# EAGLE design HallSensor (EAGLE 5.04)
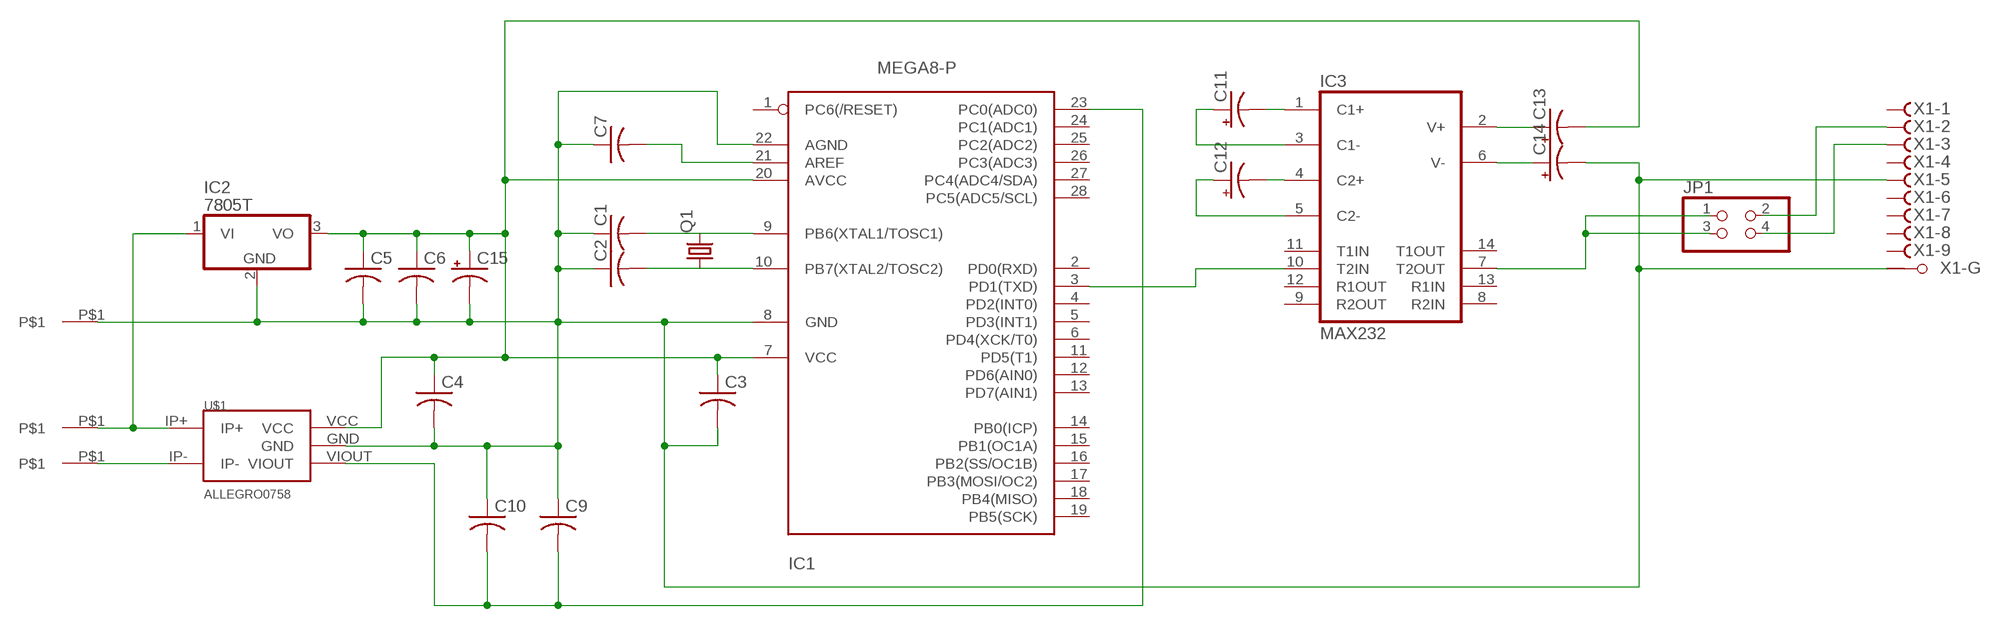
[diagram p0: schematic, sheet 1]

## Parts
C1  C-USC0805K  [C0805K]
C2  C-USC0805K  [C0805K]
C3  C-USC0805K  [C0805K]
C4  C-USC0805K  [C0805K]
C5  C-USC0805K  [C0805K]
C6  C-US025-050X050  [C025-050X050]
C7  C-USC0805K  [C0805K]
C9  C-USC0805K  [C0805K]
C10  C-US025-050X050  [C025-050X050]
C11  CPOL-US153CLV-0505  [153CLV-0505]
C12  CPOL-US153CLV-0505  [153CLV-0505]
C13  CPOL-US153CLV-0505  [153CLV-0505]
C14  CPOL-US153CLV-0505  [153CLV-0505]
C15  CPOL-US153CLV-0505  [153CLV-0505]
IC1  MEGA8-P  [DIL28-3]
IC2  7805T  [TO220H]
IC3  MAX232  [DIL16]
JP1  PINHD-2X2  [2X02]
Q1  CRYSTALTC26H  [TC26H]
U$1  ALLEGRO0758  [PSS]
U$2  TERMINAL  [TERMINAL]
U$3  TERMINAL  [TERMINAL]
U$4  TERMINAL  [TERMINAL]
X1  F09HPS  [F09HP]

## Nets
GND: C1.1 C2.1 C3.2 C4.2 C5.2 C6.2 C7.1 C9.1 C10.1 C14.- C15.- IC1.8(GND) IC1.22(AGND) IC2.2(GND) U$1.GND U$4.P$1 X1.5(-5:F) X1.G1(-G:G1)
N$1: C2.2 IC1.10(PB7(XTAL2/TOSC2)) Q1.1
N$2: C1.2 IC1.9(PB6(XTAL1/TOSC1)) Q1.2
N$3: C9.2 C10.2 IC1.23(PC0(ADC0)) U$1.VIOUT
N$6: C12.- IC3.4(C2+)
N$7: C7.2 IC1.21(AREF)
N$8: C11.- IC3.1(C1+)
N$9: C11.+ IC3.3(C1-)
N$10: C12.+ IC3.5(C2-)
N$11: C14.+ IC3.6(V-)
N$12: C13.+ IC3.2(V+)
N$13: IC1.3(PD1(TXD)) IC3.10(T2IN)
N$14: IC3.7(T2OUT) JP1.1 JP1.3
N$15: JP1.2 X1.2(-2:F)
N$16: JP1.4 X1.3(-3:F)
N$19: U$1.IP- U$3.P$1
N$20: IC2.1(VI) U$1.IP+ U$2.P$1
VCC: C3.1 C4.1 C5.1 C6.1 C13.- C15.+ IC1.7(VCC) IC1.20(AVCC) IC2.3(VO) U$1.VCC
Unconnected: IC1.1(PC6(/RESET)) IC1.2(PD0(RXD)) IC1.4(PD2(INT0)) IC1.5(PD3(INT1)) IC1.6(PD4(XCK/T0)) IC1.11(PD5(T1)) IC1.12(PD6(AIN0)) IC1.13(PD7(AIN1)) IC1.14(PB0(ICP)) IC1.15(PB1(OC1A)) IC1.16(PB2(SS/OC1B)) IC1.17(PB3(MOSI/OC2)) IC1.18(PB4(MISO)) IC1.19(PB5(SCK)) IC1.24(PC1(ADC1)) IC1.25(PC2(ADC2)) IC1.26(PC3(ADC3)) IC1.27(PC4(ADC4/SDA)) IC1.28(PC5(ADC5/SCL)) IC3.8(R2IN) IC3.9(R2OUT) IC3.11(T1IN) IC3.12(R1OUT) IC3.13(R1IN) IC3.14(T1OUT) X1.1(-1:F) X1.4(-4:F) X1.6(-6:F) X1.7(-7:F) X1.8(-8:F) X1.9(-9:F) X1.G2(-G:G2)

## Power pins joined to a net without a drawn wire
GND: IC3.15(GND)
VCC: IC3.16(VCC)

## Library data of the parts
C1-C7 C9 C10 = resistor:C-US: CAPACITOR, American symbol
C11-C15 = resistor:CPOL-US: POLARIZED CAPACITOR, American symbol
IC1 = atmel:MEGA8-P: MICROCONTROLLER 8 Kbytes FLASH, 1 kbytes SRAM, 512 bytes EEPROM, USART, 4-channel 10 bit ADC, 2-channel 8 bit ADC Pin compatible with Atmega48, ATMega88, ATMega168 Source: avr.lbr
IC2 = linear:78*: Positive VOLTAGE REGULATOR Source: http://cache.national.com/ds/LM/LM78L05.pdf http://www.fairchildsemi.com/ds/LM/LM7805.pdf
IC3 = maxim:MAX232: RS232 TRANSEIVER
JP1 = pinhead:PINHD-2X2: PIN HEADER
Q1 = crystal:CRYSTAL: CRYSTAL
U$1 = Needle Lib:ALLEGRO0758
U$2-U$4 = Needle Lib:TERMINAL
X1 = con-subd:F09HPS: SUB-D

## Board
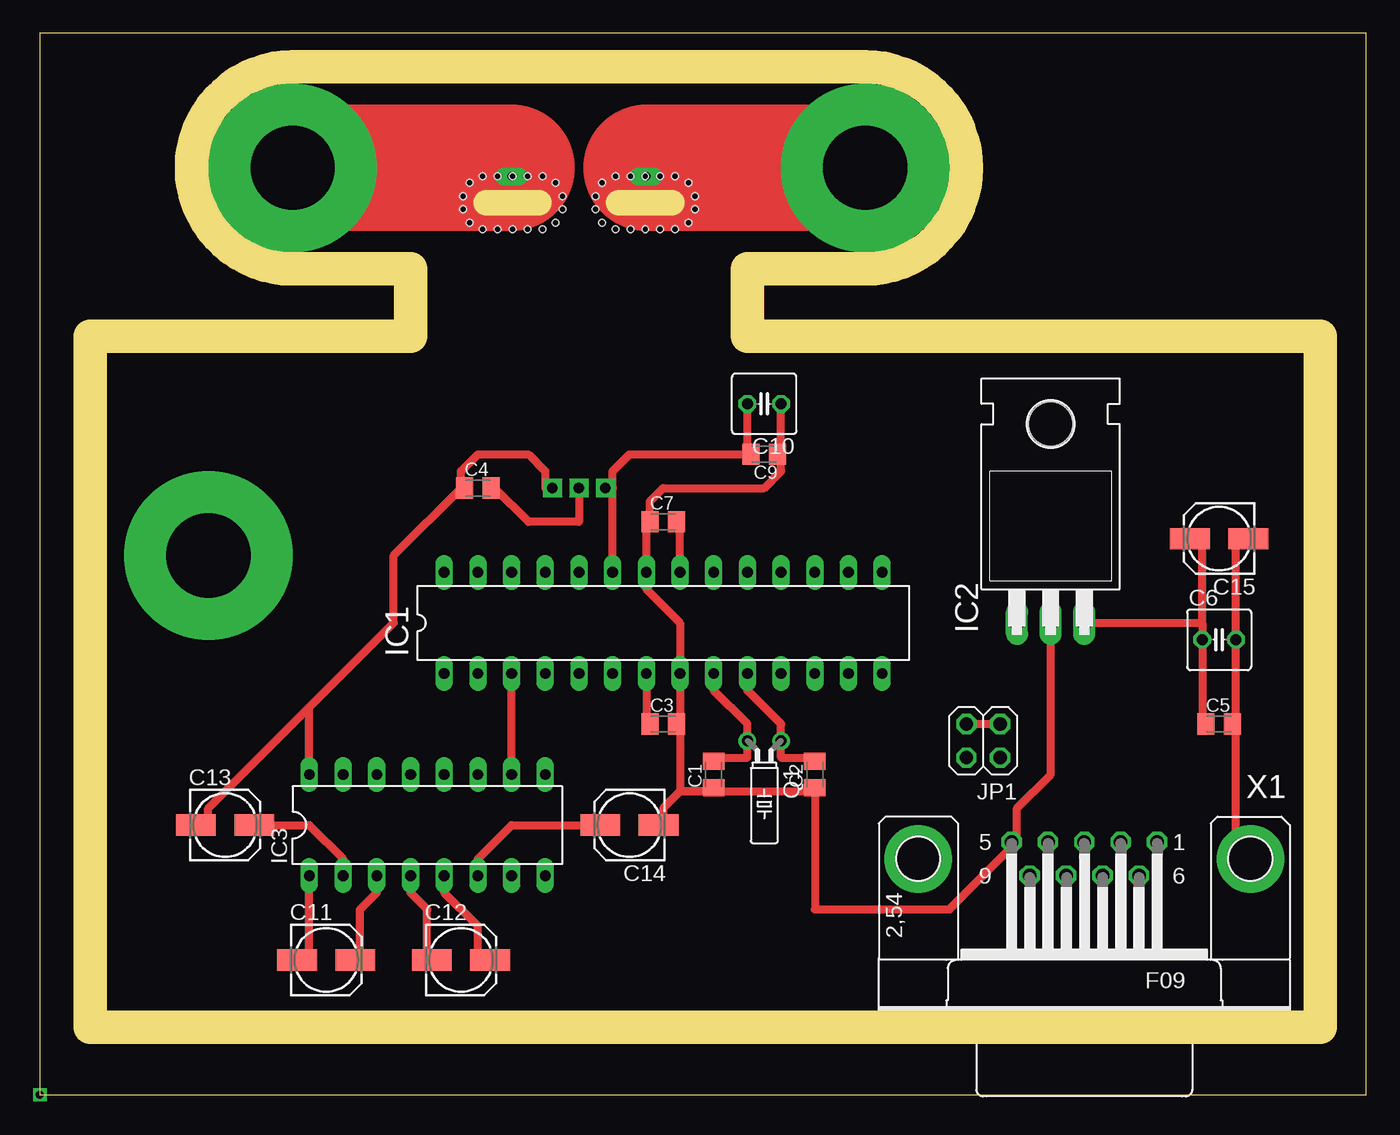
[diagram p1: board, top side]
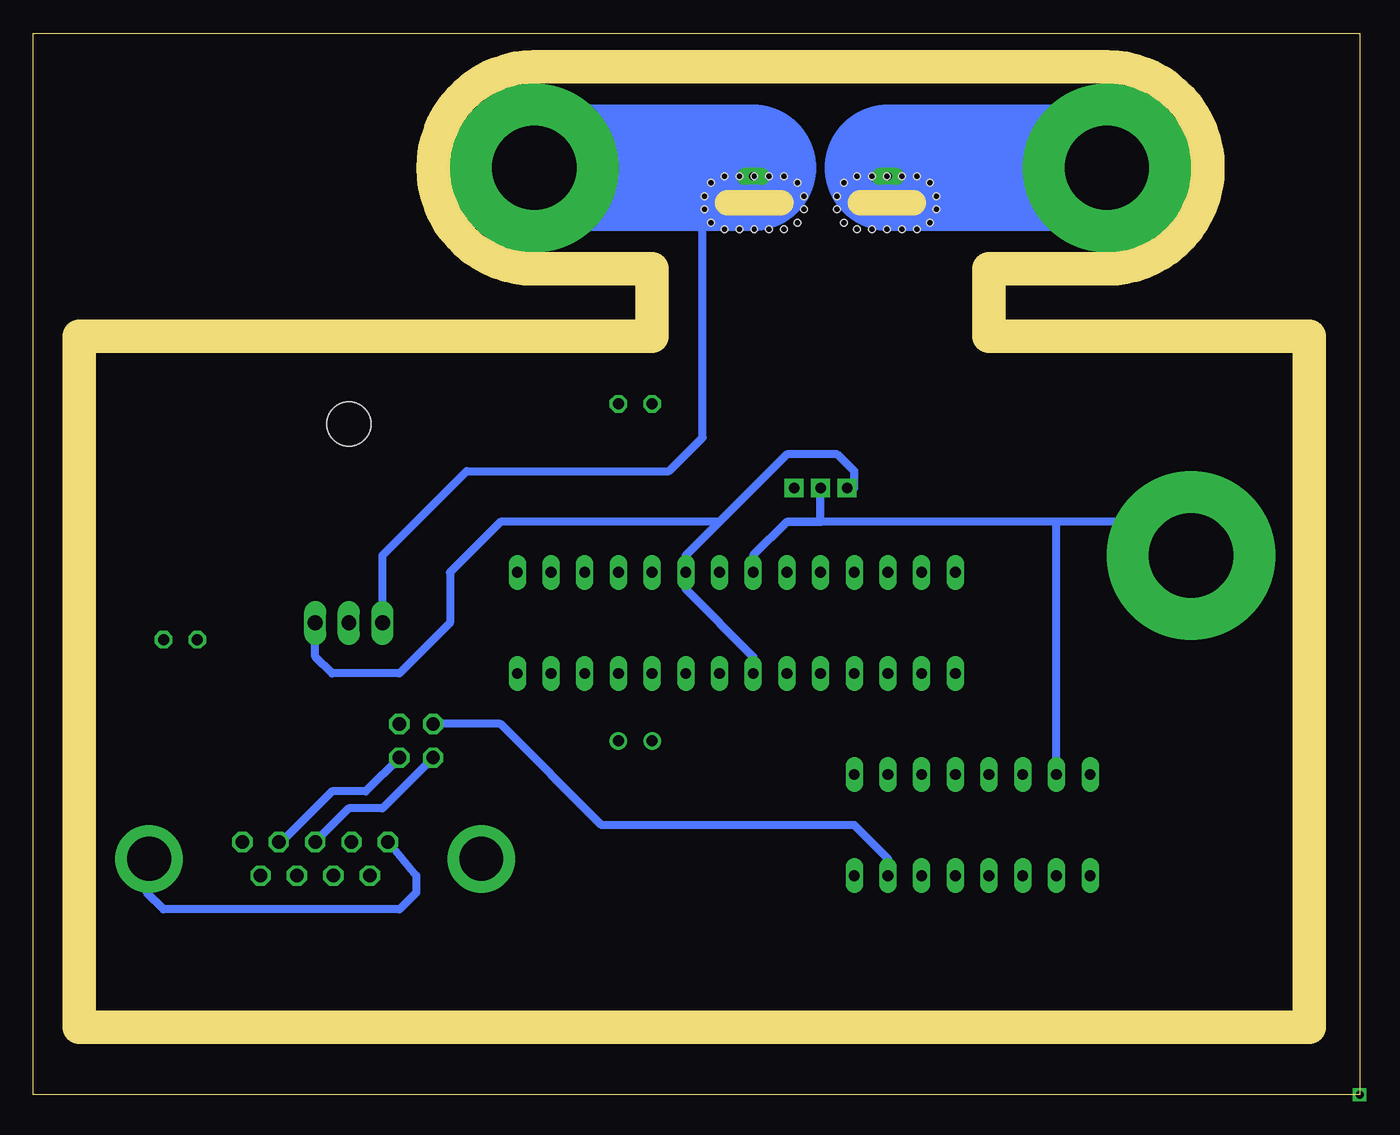
[diagram p2: board, bottom side, seen from below]

Size 100 x 80 mm. Coordinates in mm from the lower left corner, seen from the top.
Outline: 0,0 100,0 100,80 0,80 0,0
Copper layers (1*16): Top 0.035mm / dielectric 1.5mm / Bottom 0.035mm
Design rules "default": minimum track width 10mil, minimum drill 24mil, track to track 8mil, track to pad 8mil, pad to pad 8mil, via to via 8mil, smd to smd 8mil, copper to edge 40mil, drill to drill 8mil, minimum pad ring 10mil, minimum via ring 8mil, stop-mask expansion 4mil, vias tented up to drill 0mil, thermal gap 10mil
Milling: 14 lines

### Footprints (pad centres in the part's own frame; a part is rotated, then mirrored left to right if it is on the bottom)
C0805K = smd 1.3 x 1.6: 1 -1,0; 2 1,0
C025-050X050 = drill 0.813 octagon: 1 -1.27,0; 2 1.27,0
153CLV-0505 = smd 3 x 1.6: + 2.2,0; - -2.2,0
DIL28-3 = drill 0.813 long: 1 -16.51,-3.81; 2 -13.97,-3.81; 3 -11.43,-3.81; 4 -8.89,-3.81; 5 -6.35,-3.81; 6 -3.81,-3.81; 7 -1.27,-3.81; 8 1.27,-3.81; 9 3.81,-3.81; 10 6.35,-3.81; 11 8.89,-3.81; 12 11.43,-3.81; 13 13.97,-3.81; 14 16.51,-3.81; 15 16.51,3.81; 16 13.97,3.81; 17 11.43,3.81; 18 8.89,3.81; 19 6.35,3.81; 20 3.81,3.81; 21 1.27,3.81; 22 -1.27,3.81; 23 -3.81,3.81; 24 -6.35,3.81; 25 -8.89,3.81; 26 -11.43,3.81; 27 -13.97,3.81; 28 -16.51,3.81
TO220H = drill 1.118 long: 1 -2.54,-10.16; 2 0,-10.16; 3 2.54,-10.16 | hole 3.302: 0,4.826
DIL16 = drill 0.813 long: 1 -8.89,-3.81; 2 -6.35,-3.81; 3 -3.81,-3.81; 4 -1.27,-3.81; 5 1.27,-3.81; 6 3.81,-3.81; 7 6.35,-3.81; 8 8.89,-3.81; 9 8.89,3.81; 10 6.35,3.81; 11 3.81,3.81; 12 1.27,3.81; 13 -1.27,3.81; 14 -3.81,3.81; 15 -6.35,3.81; 16 -8.89,3.81
2X02 = drill 1.016 octagon: 1 -1.27,-1.27; 2 -1.27,1.27; 3 1.27,-1.27; 4 1.27,1.27
TC26H = drill 0.813 round: 1 -1.27,0; 2 1.27,0
PSS = drill 0.8 pad 1.422 square: GND 0,0; VCC -2,0; VIOUT 2,0 | drill 0.6 pad 1.27 long: IP+ 5.08,23.495; IP- -5.08,23.495 | hole 0.5: -7.25,19.5; -2.75,19.5; -3.875,19.5; -5,19.5; -6.125,19.5; -7.25,23.5; -6.125,23.5; -5,23.5; -3.875,23.5; -2.75,23.5; -1.75,23; -1.75,20; -1.25,21; -1.25,22; -8.25,23; -8.75,22; -8.75,21; -8.25,20; 2.75,19.5; 7.25,19.5; 6.125,19.5; 5,19.5; 3.875,19.5; 2.75,23.5; 3.875,23.5; 5,23.5; 6.125,23.5; 7.25,23.5; 8.25,23; 8.25,20; 8.75,21; 8.75,22; 1.75,23; 1.25,22; 1.25,21; 1.75,20
TERMINAL = drill 6.35 pad 12.7 round: P$1 0,0
F09HP = drill 1.016 octagon: 1 -5.486,-1.27; 2 -2.743,-1.27; 3 0,-1.27; 4 2.743,-1.27; 5 5.486,-1.27; 6 -4.115,1.27; 7 -1.372,1.27; 8 1.372,1.27; 9 4.115,1.27 | drill 3.302 pad 5.08 round: G1 -12.522,0; G2 12.522,0

### Placement (x,y rotation side)
C1  50.8,24.13 90 top
C2  58.42,24.13 90 top
C3  46.99,27.94 0 top
C4  33.02,45.72 0 top
C5  88.9,27.94 0 top
C6  88.9,34.29 0 top
C7  46.99,43.18 0 top
C9  54.61,48.26 180 top
C10  54.61,52.07 180 top
C11  21.59,10.16 0 top
C12  31.75,10.16 0 top
C13  13.97,20.32 0 top
C14  44.45,20.32 180 top
C15  88.9,41.91 180 top
IC1  46.99,35.56 0 top
IC2  76.2,45.72 0 top
IC3  29.21,20.32 0 top
JP1  71.12,26.67 180 top
Q1  54.61,26.67 180 top
U$1  40.64,45.72 0 top
U$2  62.23,69.85 0 top
U$3  19.05,69.85 0 top
U$4  12.7,40.64 0 top
X1  78.74,17.78 180 top

### Tracks (layer width: path | path; a pad name or v marks a point on that pad's centre or on a via)
GND
  Top 0.254: 90.17,41.91 C15.- | 90.17,27.94 C5.2 | 34.29,45.72 C4.2 | 45.72,43.18 C7.1 | 50.8,22.86 C1.1 | 48.26,27.94 C3.2 | 46.99,20.32 C14.- | 58.42,22.86 C2.1
  Top 0.61: 90.17,41.91 C6.2 90.17,27.94 90.17,19.05 X1.G1 | 73.66,19.05 73.66,21.59 76.2,24.13 IC2.2 | 34.29,45.72 36.83,43.18 40.64,43.18 U$1.GND | 55.88,48.26 C10.1 | 45.72,43.18 IC1.22 45.72,38.1 48.26,35.56 IC1.8 48.26,27.94 48.26,22.86 | 48.26,22.86 50.8,22.86 58.42,22.86 58.42,13.97 68.58,13.97 73.66,19.05 | 73.66,19.05 X1.5 | C7.1 45.99,44.72 46.99,45.72 54.61,45.72 55.88,46.99 55.88,48.26 | 55.88,48.26 C9.1 | 46.99,20.32 46.99,21.59 48.26,22.86 | 48.26,22.86 50.53,22.86 C1.1
  Bottom 0.61: X1.5 71.12,16.51 71.12,15.24 72.39,13.97 90.17,13.97 91.44,15.24 X1.G1 | 43.18,43.18 45.72,40.64 IC1.22 | 43.18,43.18 40.64,43.18 U$1.GND | 22.86,43.18 17.78,43.18 U$4.P$1 | 22.86,43.18 43.18,43.18 | IC3.15 22.86,43.18
N$1
  Top 0.254: 58.42,25.4 C2.2
  Top 0.61: 58.42,25.4 55.88,25.4 Q1.1 55.88,27.94 53.34,30.48 IC1.10
N$2
  Top 0.254: C1.2 50.8,25.4
  Top 0.61: 50.8,25.4 53.34,25.4 Q1.2 53.34,27.94 50.8,30.48 IC1.9
N$3
  Top 0.254: 53.34,48.26 C9.2 | 43.18,45.72 U$1.VIOUT
  Top 0.61: C10.2 53.34,48.26 44.45,48.26 43.18,46.99 43.18,45.72 IC1.23
N$4  (via drill 0.6)
  other vias: 0,0
N$6
  Top 0.254: C12.- 29.21,10.16
  Top 0.61: 29.21,10.16 29.21,13.97 27.94,15.24 IC3.4
N$7
  Top 0.254: 48.26,43.18 C7.2
  Top 0.61: IC1.21 48.26,43.18
N$8
  Top 0.254: C11.- 20.32,10.16
  Top 0.61: 20.32,10.16 IC3.1
N$9
  Top 0.254: C11.+ 24.13,10.16
  Top 0.61: 24.13,10.16 24.13,13.97 25.4,15.24 IC3.3
N$10
  Top 0.254: C12.+ 33.02,10.16
  Top 0.61: 33.02,10.16 33.02,12.7 30.48,15.24 IC3.5
N$11
  Top 0.61: IC3.6 33.02,17.78 35.56,20.32 C14.+
N$12
  Top 0.61: IC3.2 22.86,17.78 20.32,20.32 C13.+
N$13
  Top 0.61: IC3.10 IC1.3
N$14
  Top 0.61: JP1.3 JP1.1
  Bottom 0.61: JP1.3 64.77,27.94 57.15,20.32 38.1,20.32 35.56,17.78 IC3.7
N$15
  Bottom 0.254: 81.28,19.05 X1.2
  Bottom 0.61: JP1.2 74.93,22.86 77.47,22.86 81.28,19.05
N$16
  Bottom 0.61: JP1.4 73.66,21.59 76.2,21.59 X1.3
N$19
  Top 9.525: U$3.P$1 35.56,69.85
  Bottom 6.452: 35.56,69.85 U$1.IP-
  Bottom 9.525: U$3.P$1 35.56,69.85
N$20
  Top 9.525: 45.72,69.85 U$2.P$1
  Bottom 0.61: IC2.1 73.66,40.64 67.31,46.99 52.07,46.99 49.53,49.53 49.53,66.04 45.72,69.85
  Bottom 6.452: 45.72,69.85 U$1.IP+
  Bottom 9.525: U$2.P$1 45.72,69.85
VCC
  Top 0.254: 87.63,27.94 C5.1 | 87.63,41.91 C15.+ | 45.72,27.94 C3.1 | C13.- 12.7,20.32 | 31.75,45.72 C4.1
  Top 0.61: 87.63,27.94 C6.1 87.63,35.56 | 87.63,35.56 87.63,41.91 | IC2.3 87.63,35.56 | IC1.7 45.72,27.94 | U$1.VCC 38.1,45.72 38.1,46.99 36.83,48.26 33.02,48.26 31.75,46.99 31.75,45.72 26.67,40.64 26.67,35.56 20.32,29.21 | 12.7,20.32 12.7,21.59 20.32,29.21 | IC3.16 20.32,29.21
  Bottom 0.61: IC1.7 45.72,33.02 50.8,38.1 IC1.20 50.8,40.64 48.26,43.18 | 48.26,43.18 43.18,48.26 39.37,48.26 38.1,46.99 38.1,45.72 U$1.VCC | 48.26,43.18 64.77,43.18 68.58,39.37 68.58,35.56 72.39,31.75 77.47,31.75 78.74,33.02 IC2.3